# EAGLE design SuperPro-res-moved (EAGLE 6.6.0)
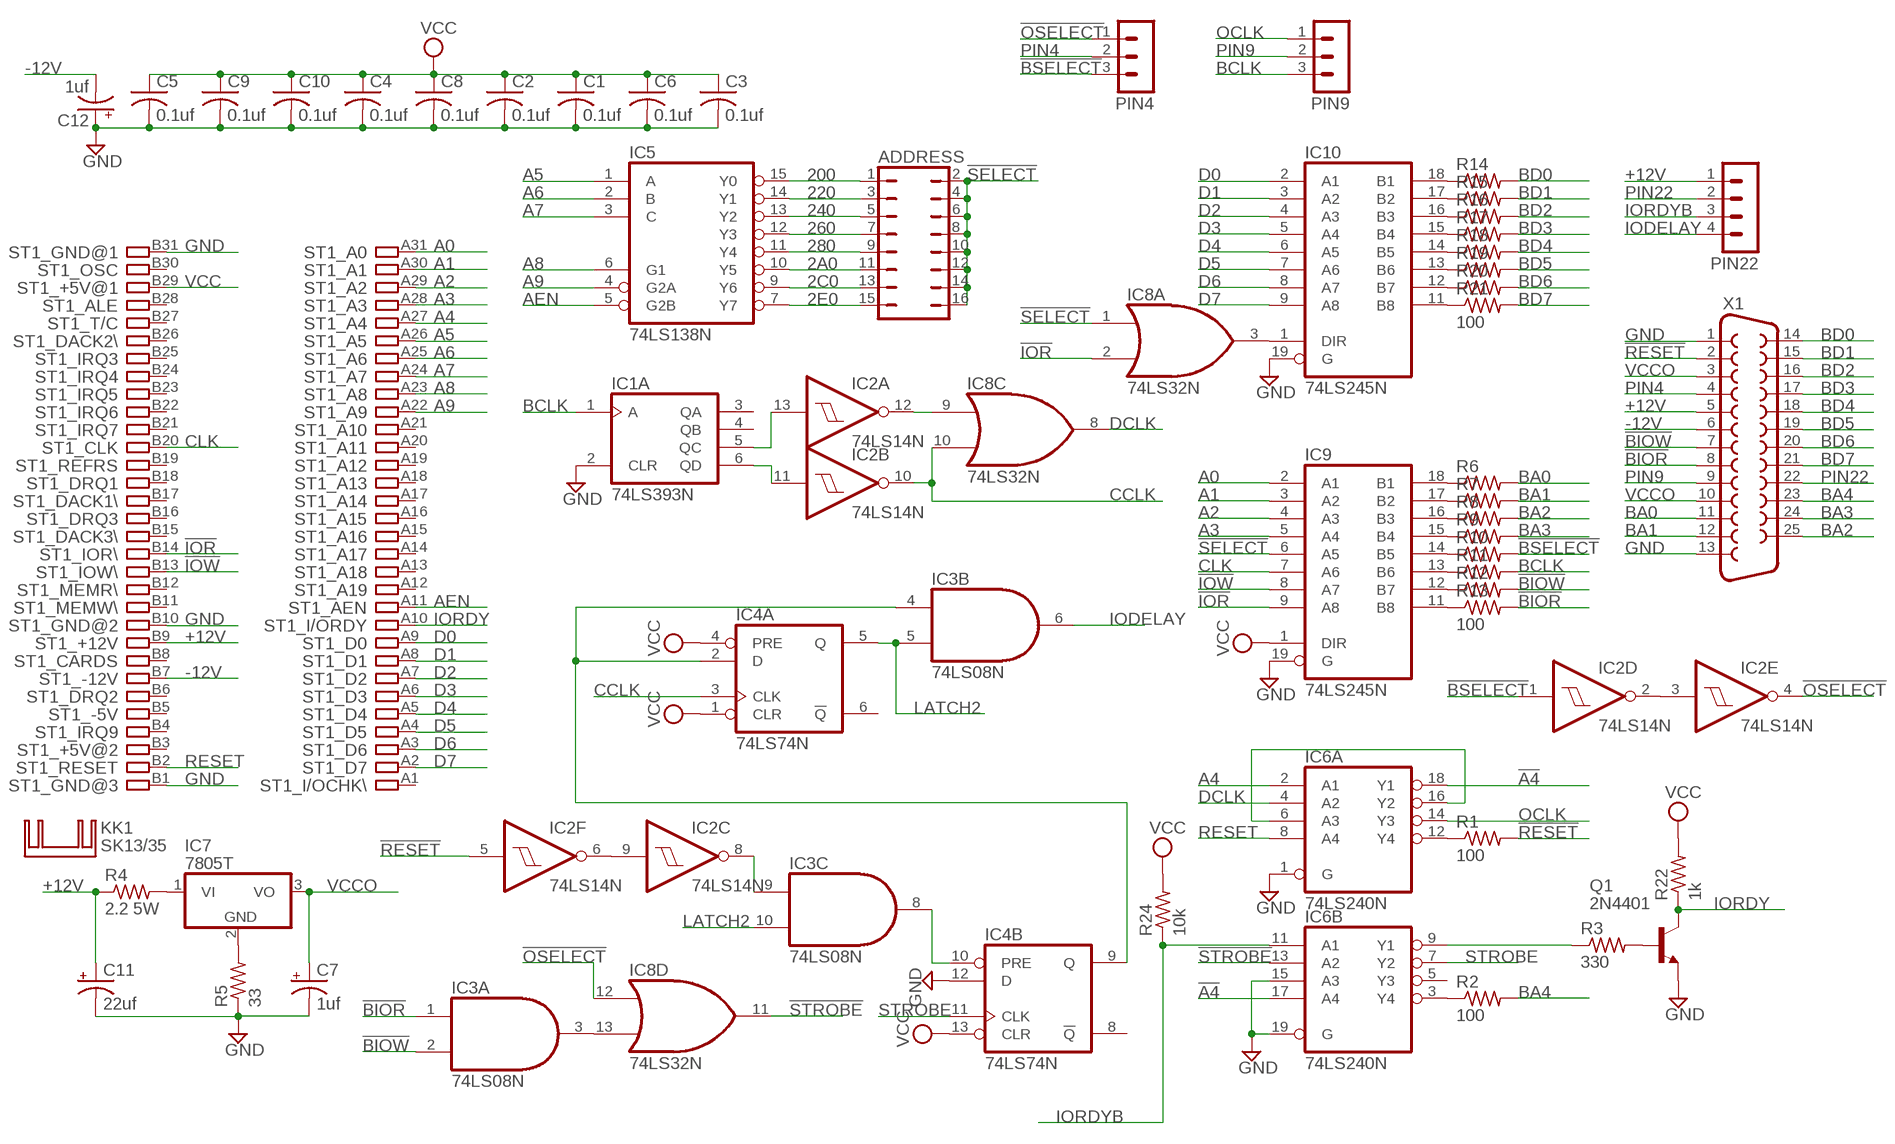
[diagram p0: schematic, sheet 1]

## Parts
ADDRESS  JP8Q  [JP8Q]
C1  0.1uf  C-US050-025X075  [C050-025X075]
C2  0.1uf  C-US050-025X075  [C050-025X075]
C3  0.1uf  C-US050-025X075  [C050-025X075]
C4  0.1uf  C-US050-025X075  [C050-025X075]
C5  0.1uf  C-US050-025X075  [C050-025X075]
C6  0.1uf  C-US050-025X075  [C050-025X075]
C7  1uf  CPOL-USE5-10.5  [E5-10,5]
C8  0.1uf  C-US050-025X075  [C050-025X075]
C9  0.1uf  C-US050-025X075  [C050-025X075]
C10  0.1uf  C-US050-025X075  [C050-025X075]
C11  22uf  CPOL-USE5-10.5  [E5-10,5]
C12  1uf  CPOL-USE5-10.5  [E5-10,5]
IC1  74LS393N  [DIL14]
IC2  74LS14N  [DIL14]
IC3  74LS08N  [DIL14]
IC4  74LS74N  [DIL14]
IC5  74LS138N  [DIL16]
IC6  74LS240N  [DIL20]
IC7  7805T  [TO220H]
IC8  74LS32N  [DIL14]
IC9  74LS245N  [DIL20]
IC10  74LS245N  [DIL20]
KK1  SK13/35  [SK13/35]
PIN4  MA03-1  [MA03-1]
PIN9  MA03-1  [MA03-1]
PIN22  MA04-1  [MA04-1]
Q1  2N4401  2N4416  [TO92]
R1  100  R-US_0207/10  [0207/10]
R2  100  R-US_0207/10  [0207/10]
R3  330  R-US_0207/10  [0207/10]
R4  2.2 5W  R-US_0922/22  [0922/22]
R5  33  R-US_0207/10  [0207/10]
R6  R-US_0207/10  [0207/10]
R7  R-US_0207/10  [0207/10]
R8  R-US_0207/10  [0207/10]
R9  R-US_0207/10  [0207/10]
R10  R-US_0207/10  [0207/10]
R11  R-US_0207/10  [0207/10]
R12  R-US_0207/10  [0207/10]
R13  100  R-US_0207/10  [0207/10]
R14  R-US_0207/10  [0207/10]
R15  R-US_0207/10  [0207/10]
R16  R-US_0207/10  [0207/10]
R17  R-US_0207/10  [0207/10]
R18  R-US_0207/10  [0207/10]
R19  R-US_0207/10  [0207/10]
R20  R-US_0207/10  [0207/10]
R21  100  R-US_0207/10  [0207/10]
R22  1k  R-US_0207/10  [0207/10]
R24  10k  R-US_0207/10  [0207/10]
ST1  IBM8BIT  [IBM8BIT]
X1  F25H  [F25H]

## Nets
2A0: ADDRESS.11 IC5.10(Y5)
2C0: ADDRESS.13 IC5.9(Y6)
2E0: ADDRESS.15 IC5.7(Y7)
200: ADDRESS.1 IC5.15(Y0)
220: ADDRESS.3 IC5.14(Y1)
240: ADDRESS.5 IC5.13(Y2)
260: ADDRESS.7 IC5.12(Y3)
280: ADDRESS.9 IC5.11(Y4)
!A4: IC6.17(B:A4) IC6.18(A:Y1)
!BIOR: IC3.1(A:I0) R13.2 X1.8
!BIOW: IC3.2(A:I1) R12.2 X1.7
!BSELECT: IC2.1(D:I) PIN4.3 R10.2
!IOR: IC8.2(A:I1) IC9.9(A8) ST1.B14
!IOW: IC9.8(A7) ST1.B13
!OSELECT: IC2.4(E:O) IC8.12(D:I0) PIN4.1
!RESET: IC2.5(F:I) R1.2 X1.2
!SELECT: ADDRESS.2 ADDRESS.4 ADDRESS.6 ADDRESS.8 ADDRESS.10 ADDRESS.12 ADDRESS.14 ADDRESS.16 IC8.1(A:I0) IC9.6(A5)
!STROBE: IC6.13(B:A2) IC8.11(D:O)
+12V [Power]: C11.+ PIN22.1 R4.1 ST1.B9 X1.5
-12V [Power]: C12.- ST1.B7 X1.6
A0: IC9.2(A1) ST1.A31
A1: IC9.3(A2) ST1.A30
A2: IC9.4(A3) ST1.A29
A3: IC9.5(A4) ST1.A28
A4: IC6.2(A:A1) ST1.A27
A5: IC5.1(A) ST1.A26
A6: IC5.2(B) ST1.A25
A7: IC5.3(C) ST1.A24
A8: IC5.6(G1) ST1.A23
A9: IC5.4(G2A) ST1.A22
AEN: IC5.5(G2B) ST1.A11
BA0: R6.2 X1.11
BA1: R7.2 X1.12
BA2: R8.2 X1.25
BA3: R9.2 X1.24
BA4: R2.2 X1.23
BCLK: IC1.1(A:A) PIN9.3 R11.2
BD0: R14.2 X1.14
BD1: R15.2 X1.15
BD2: R16.2 X1.16
BD3: R17.2 X1.17
BD4: R18.2 X1.18
BD5: R19.2 X1.19
BD6: R20.2 X1.20
BD7: R21.2 X1.21
CCLK: IC2.10(B:O) IC4.3(A:CLK) IC8.10(C:I1)
CLK: IC9.7(A6) ST1.B20
D0: IC10.2(A1) ST1.A9
D1: IC10.3(A2) ST1.A8
D2: IC10.4(A3) ST1.A7
D3: IC10.5(A4) ST1.A6
D4: IC10.6(A5) ST1.A5
D5: IC10.7(A6) ST1.A4
D6: IC10.8(A7) ST1.A3
D7: IC10.9(A8) ST1.A2
DCLK: IC6.4(A:A2) IC8.8(C:O)
GND: C1.2 C2.2 C3.2 C4.2 C5.2 C6.2 C7.- C8.2 C9.2 C10.2 C11.- C12.+ IC1.2(A:CLR) IC4.12(B:D) IC6.1(A:G) IC6.15(B:A3) IC6.19(B:G) IC9.19(G) IC10.19(G) Q1.3(E) R5.1 ST1.B1 ST1.B10 ST1.B31 X1.1 X1.13
IODELAY: IC3.6(B:O) PIN22.4
IORDY: Q1.1(C) R22.1 ST1.A10
IORDYB: IC6.11(B:A1) PIN22.3 R24.1
LATCH2: IC3.5(B:I1) IC3.10(C:I1) IC4.5(A:Q)
N$1: IC8.3(A:O) IC10.1(DIR)
N$2 [Power]: IC7.2(GND) R5.2
N$3: IC10.13(B6) R19.1
N$4: IC10.17(B2) R15.1
N$5: IC10.16(B3) R16.1
N$6: IC10.15(B4) R17.1
N$7: IC10.14(B5) R18.1
N$8: IC10.12(B7) R20.1
N$9: IC10.11(B8) R21.1
N$10: IC10.18(B1) R14.1
N$11: IC9.18(B1) R6.1
N$12: IC9.17(B2) R7.1
N$13: IC9.16(B3) R8.1
N$14: IC9.15(B4) R9.1
N$15: IC9.14(B5) R10.1
N$16: IC9.13(B6) R11.1
N$17: IC9.12(B7) R12.1
N$18: IC9.11(B8) R13.1
N$19: IC6.12(A:Y4) R1.1
N$20: IC2.6(F:O) IC2.9(C:I)
N$21: IC2.2(D:O) IC2.3(E:I)
N$22: IC1.6(A:QD) IC2.11(B:I)
N$23: IC6.3(B:Y4) R2.1
N$24: IC1.5(A:QC) IC2.13(A:I)
N$25 [Power]: IC7.1(VI) R4.2
N$26: IC2.12(A:O) IC8.9(C:I0)
N$28: IC6.6(A:A3) IC6.16(A:Y2)
N$29: IC3.3(A:O) IC8.13(D:I1)
N$30: IC3.4(B:I0) IC4.2(A:D) IC4.9(B:Q)
N$32: IC6.9(B:Y1) R3.1
N$33: IC3.8(C:O) IC4.10(B:PRE)
N$34: IC2.8(C:O) IC3.9(C:I0)
N$37: Q1.2(B) R3.2
OCLK: IC6.14(A:Y3) PIN9.1
PIN4: PIN4.2 X1.4
PIN9: PIN9.2 X1.9
PIN22 [Power]: PIN22.2 X1.22
RESET: IC6.8(A:A4) ST1.B2
STROBE: IC4.11(B:CLK) IC6.7(B:Y2)
VCC [Power]: C1.1 C2.1 C3.1 C4.1 C5.1 C6.1 C8.1 C9.1 C10.1 IC4.1(A:CLR) IC4.4(A:PRE) IC4.13(B:CLR) IC9.1(DIR) R22.2 R24.2 ST1.B29
VCCO [Power]: C7.+ IC7.3(VO) X1.3 X1.10
Unconnected: IC1.3(A:QA) IC1.4(A:QB) IC1.8(B:QD) IC1.9(B:QC) IC1.10(B:QB) IC1.11(B:QA) IC1.12(B:CLR) IC1.13(B:A) IC3.11(D:O) IC3.12(D:I0) IC3.13(D:I1) IC4.6(A:!Q) IC4.8(B:!Q) IC6.5(B:Y3) IC8.4(B:I0) IC8.5(B:I1) IC8.6(B:O) ST1.A1 ST1.A12 ST1.A13 ST1.A14 ST1.A15 ST1.A16 ST1.A17 ST1.A18 ST1.A19 ST1.A20 ST1.A21 ST1.B3 ST1.B4 ST1.B5 ST1.B6 ST1.B8 ST1.B11 ST1.B12 ST1.B15 ST1.B16 ST1.B17 ST1.B18 ST1.B19 ST1.B21 ST1.B22 ST1.B23 ST1.B24 ST1.B25 ST1.B26 ST1.B27 ST1.B28 ST1.B30

## Power pins joined to a net without a drawn wire
GND: IC1.7(P:GND) IC2.7(P:GND) IC3.7(P:GND) IC4.7(P:GND) IC5.8(GND) IC6.10(P:GND) IC8.7(P:GND) IC9.10(GND) IC10.10(GND)
VCC: IC1.14(P:VCC) IC2.14(P:VCC) IC3.14(P:VCC) IC4.14(P:VCC) IC5.16(VCC) IC6.20(P:VCC) IC8.14(P:VCC) IC9.20(VCC) IC10.20(VCC)

## Library data of the parts
ADDRESS = jumper:JP8Q: JUMPER
C1-C6 C8-C10 = rcl:C-US: CAPACITOR, American symbol
C7 C11 C12 = rcl:CPOL-US: POLARIZED CAPACITOR, American symbol
IC1 = 74xx-us:74*393: Dual 4-bit decade and binary COUNTER
IC2 = 74xx-us:74*14: Hex schmitt trigger INVERTER
IC3 = 74xx-us:74*08: Quad 2-input AND gate
IC4 = 74xx-us:74*74: Dual D type positive edge triggered FLIP FLOP, preset and clear
IC5 = 74xx-us:74*138: 3-line to 8-line DECODER/DEMULTIPLEXER
IC6 = 74xx-us:74*240: Octal BUFFER and LINE DRIVER, 3-state
IC7 = linear:78*: Positive VOLTAGE REGULATOR Source: http://cache.national.com/ds/LM/LM78L05.pdf http://www.fairchildsemi.com/ds/LM/LM7805.pdf
IC8 = 74xx-us:74*32: Quad 2-input OR gate
IC9 IC10 = 74xx-us:74*245: Octal BUS TRANSCEIVER, 3-state
KK1 = heatsink:SK13/35: HEATSINK manufacturer Fischer/distributor Buerklin
PIN4 PIN9 = con-lstb:MA03-1: PIN HEADER; OC_FARNELL: unknown; OC_NEWARK: unknown
PIN22 = con-lstb:MA04-1: PIN HEADER; OC_FARNELL: unknown; OC_NEWARK: unknown
Q1 = transistor-npn:2N4416: NPN Transistor
R1-R22 R24 = rcl:R-US_: RESISTOR, American symbol
ST1 = con-pc:IBM8BIT: 8-bit CARD IBM/PC-AT
X1 = con-subd:F25: SUB-D; OC_FARNELL: unknown; OC_NEWARK: unknown

## Net classes
1 Power: width 0.762 mm, clearance 0.254 mm

## Board
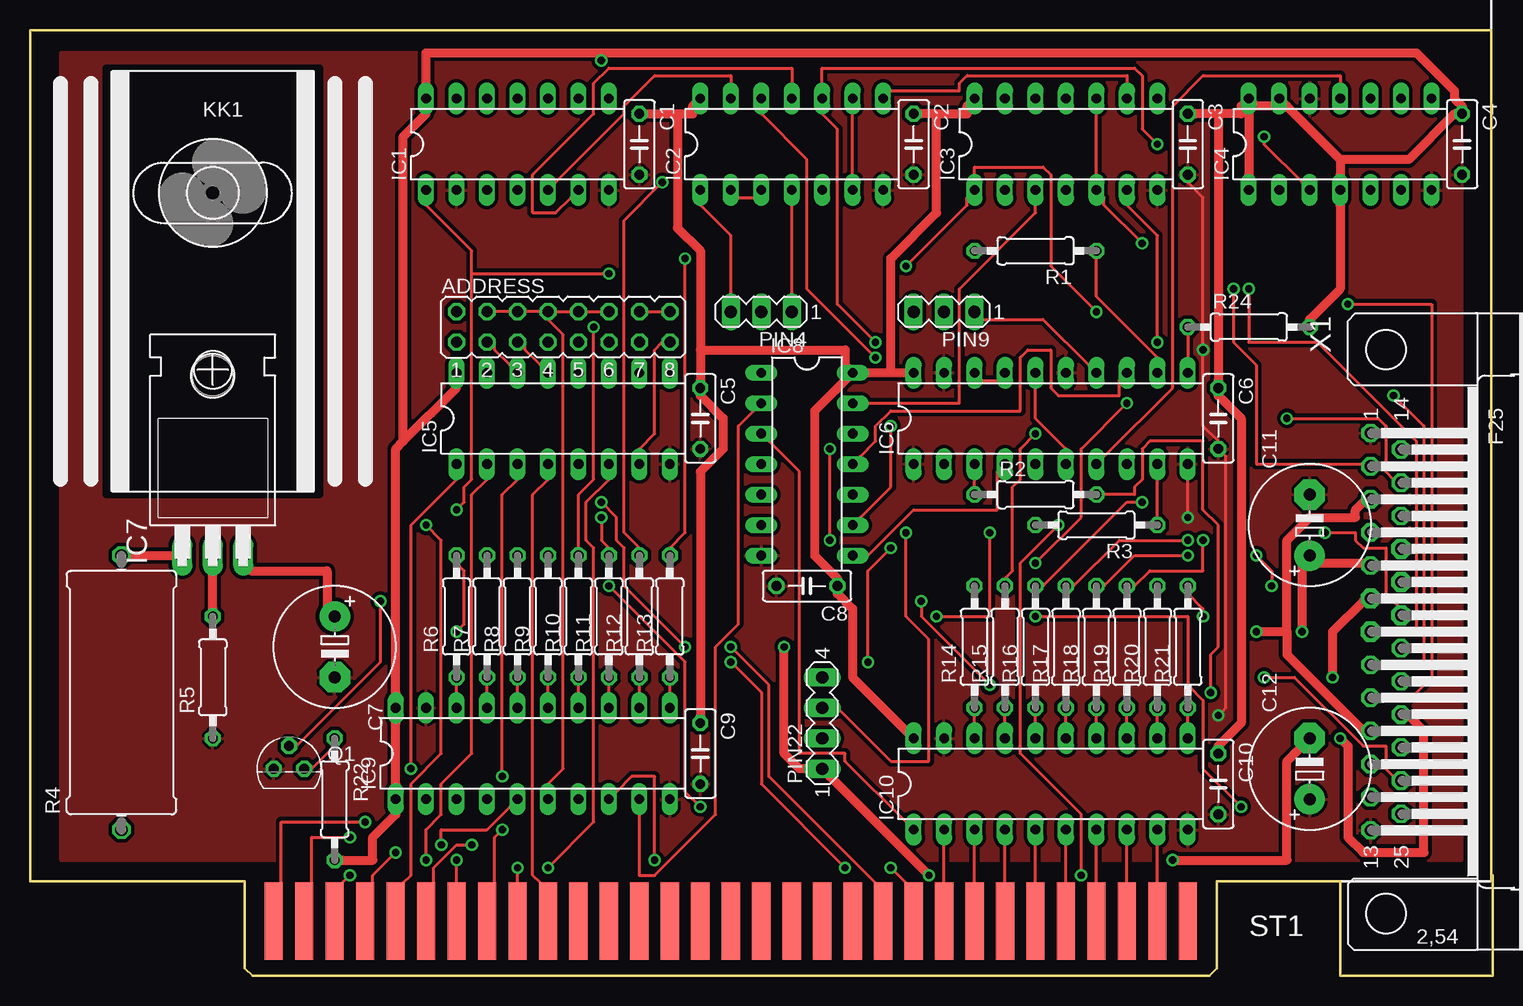
[diagram p1: board, top side]
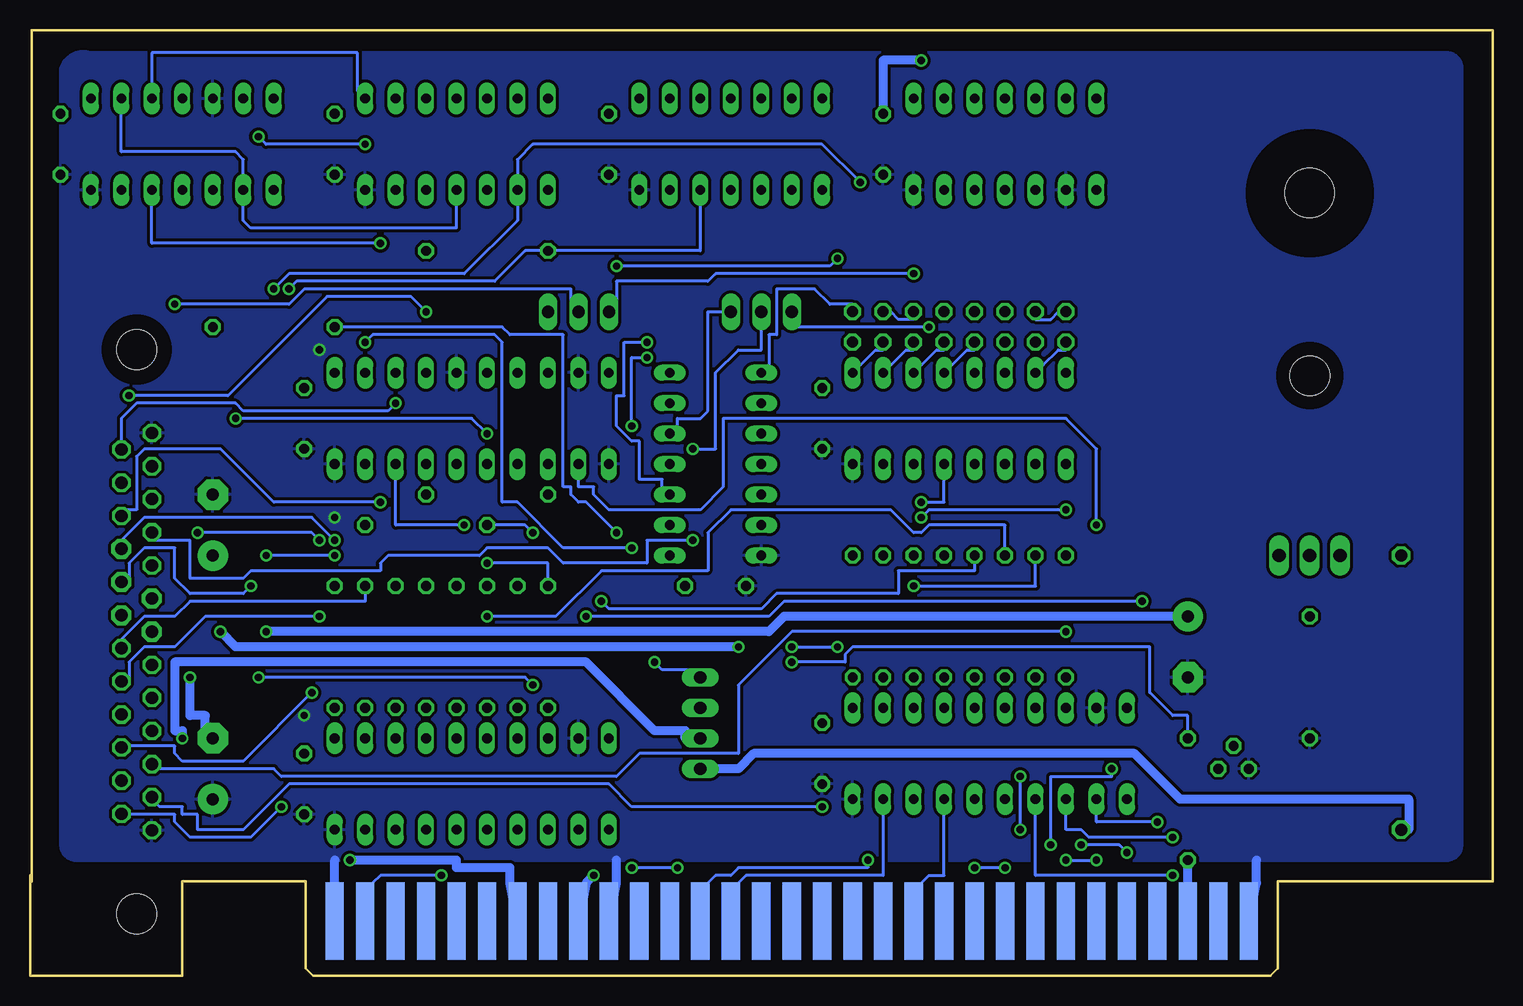
[diagram p2: board, bottom side, seen from below]

Size 121.92 x 78.87 mm. Coordinates in mm from the lower left corner, seen from the top.
Outline: 121.79,7.87 121.79,78.87 0,78.87 0,7.87 17.91,7.87 17.91,0.63 18.54,0 97.79,0 98.3,0 98.93,0.63 98.93,7.87 109.22,7.87 109.22,0 121.92,0 121.92,8.38
Copper layers (1*16): Top 0.035mm / dielectric 1.5mm / Bottom 0.035mm
Design rules "olimex10mil": minimum track width 10mil, minimum drill 24mil, track to track 10mil, track to pad 10mil, pad to pad 10mil, via to via 10mil, smd to smd 10mil, copper to edge 40mil, drill to drill 10mil, minimum pad ring 10mil, minimum via ring 8mil, stop-mask expansion 0mil, vias tented up to drill 0mil, thermal gap 10mil

### Footprints (pad centres in the part's own frame; a part is rotated, then mirrored left to right if it is on the bottom)
JP8Q = drill 0.914 octagon: 1 -8.89,-1.27; 2 -8.89,1.27; 3 -6.35,-1.27; 4 -6.35,1.27; 5 -3.81,-1.27; 6 -3.81,1.27; 7 -1.27,-1.27; 8 -1.27,1.27; 9 1.27,-1.27; 10 1.27,1.27; 11 3.81,-1.27; 12 3.81,1.27; 13 6.35,-1.27; 14 6.35,1.27; 15 8.89,-1.27; 16 8.89,1.27
C050-025X075 = drill 0.813 octagon: 1 -2.54,0; 2 2.54,0
E5-10,5 = drill 1.016 pad 2.54: + -2.54,0 | drill 1.016 pad 2.54 octagon: - 2.54,0
DIL14 = drill 0.813 long: 1 -7.62,-3.81; 2 -5.08,-3.81; 3 -2.54,-3.81; 4 0,-3.81; 5 2.54,-3.81; 6 5.08,-3.81; 7 7.62,-3.81; 8 7.62,3.81; 9 5.08,3.81; 10 2.54,3.81; 11 0,3.81; 12 -2.54,3.81; 13 -5.08,3.81; 14 -7.62,3.81
DIL16 = drill 0.813 long: 1 -8.89,-3.81; 2 -6.35,-3.81; 3 -3.81,-3.81; 4 -1.27,-3.81; 5 1.27,-3.81; 6 3.81,-3.81; 7 6.35,-3.81; 8 8.89,-3.81; 9 8.89,3.81; 10 6.35,3.81; 11 3.81,3.81; 12 1.27,3.81; 13 -1.27,3.81; 14 -3.81,3.81; 15 -6.35,3.81; 16 -8.89,3.81
DIL20 = drill 0.813 long: 1 -11.43,-3.81; 2 -8.89,-3.81; 3 -6.35,-3.81; 4 -3.81,-3.81; 5 -1.27,-3.81; 6 1.27,-3.81; 7 3.81,-3.81; 8 6.35,-3.81; 9 8.89,-3.81; 10 11.43,-3.81; 11 11.43,3.81; 12 8.89,3.81; 13 6.35,3.81; 14 3.81,3.81; 15 1.27,3.81; 16 -1.27,3.81; 17 -3.81,3.81; 18 -6.35,3.81; 19 -8.89,3.81; 20 -11.43,3.81
TO220H = drill 1.118 long: 1 -2.54,-10.16; 2 0,-10.16; 3 2.54,-10.16 | hole 3.302: 0,4.826
MA03-1 = drill 1.016 long: 1 -2.54,0; 2 0,0; 3 2.54,0
MA04-1 = drill 1.016 long: 1 -3.81,0; 2 -1.27,0; 3 1.27,0; 4 3.81,0
TO92 = drill 0.813 octagon: 1 1.27,0; 2 0,1.905; 3 -1.27,0
0207/10 = drill 0.813 octagon: 1 -5.08,0; 2 5.08,0
0922/22 = drill 1.016 octagon: 1 -11.43,0; 2 11.43,0
IBM8BIT = smd 1.524 x 6.477: A1 -25.4,5.08; A2 -27.94,5.08; A3 -30.48,5.08; A4 -33.02,5.08; A5 -35.56,5.08; A6 -38.1,5.08; A7 -40.64,5.08; A8 -43.18,5.08; A9 -45.72,5.08; A10 -48.26,5.08; A11 -50.8,5.08; A12 -53.34,5.08; A13 -55.88,5.08; A14 -58.42,5.08; A15 -60.96,5.08; A16 -63.5,5.08; A17 -66.04,5.08; A18 -68.58,5.08; A19 -71.12,5.08; A20 -73.66,5.08; A21 -76.2,5.08; A22 -78.74,5.08; A23 -81.28,5.08; A24 -83.82,5.08; A25 -86.36,5.08; A26 -88.9,5.08; A27 -91.44,5.08; A28 -93.98,5.08; A29 -96.52,5.08; A30 -99.06,5.08; A31 -101.6,5.08 | smd 1.524 x 6.477 bottom: B1 -25.4,5.08; B2 -27.94,5.08; B3 -30.48,5.08; B4 -33.02,5.08; B5 -35.56,5.08; B6 -38.1,5.08; B7 -40.64,5.08; B8 -43.18,5.08; B9 -45.72,5.08; B10 -48.26,5.08; B11 -50.8,5.08; B12 -53.34,5.08; B13 -55.88,5.08; B14 -58.42,5.08; B15 -60.96,5.08; B16 -63.5,5.08; B17 -66.04,5.08; B18 -68.58,5.08; B19 -71.12,5.08; B20 -73.66,5.08; B21 -76.2,5.08; B22 -78.74,5.08; B23 -81.28,5.08; B24 -83.82,5.08; B25 -86.36,5.08; B26 -88.9,5.08; B27 -91.44,5.08; B28 -93.98,5.08; B29 -96.52,5.08; B30 -99.06,5.08; B31 -101.6,5.08
4,1 = hole 4.1: 0,0
F25H = drill 1.016 octagon: 1 -16.561,-1.27; 2 -13.792,-1.27; 3 -11.049,-1.27; 4 -8.28,-1.27; 5 -5.512,-1.27; 8 2.769,-1.27; 9 5.512,-1.27; 10 8.28,-1.27; 11 11.049,-1.27; 12 13.792,-1.27; 13 16.561,-1.27; 14 -15.189,1.27; 15 -12.421,1.27; 16 -9.652,1.27; 20 1.372,1.27; 21 4.14,1.27; 22 6.909,1.27; 23 9.652,1.27; 24 12.421,1.27; 25 15.189,1.27 | drill 1.016 pad 1.67 octagon: 6 -2.769,-1.27; 7 0,-1.27; 17 -6.909,1.27; 18 -4.14,1.27; 19 -1.372,1.27 | hole 3.302: -23.52,0; 23.52,0

### Placement (x,y rotation side)
ADDRESS  44.45,54.1 0 top
C1  50.8,69.34 270 top
C2  73.66,69.34 270 top
C3  96.52,69.34 270 top
C4  119.38,69.34 270 top
C5  55.88,46.48 270 top
C6  99.06,46.48 270 top
C7  25.4,27.43 270 top
C8  64.77,32.51 180 top
C9  55.88,18.54 270 top
C10  99.06,16 270 top
C11  106.68,37.59 90 top
C12  106.68,17.27 90 top
IC1  40.64,69.34 0 top
IC2  63.5,69.34 0 top
IC3  86.36,69.34 0 top
IC4  109.22,69.34 0 top
IC5  44.45,46.48 0 top
IC6  85.09,46.48 0 top
IC7  15.24,45.21 0 top
IC8  64.77,42.67 270 top
IC9  41.91,18.54 0 top
IC10  85.09,16 0 top
KK1  15.24,61.72 90 top
PIN4  60.96,55.37 180 top
PIN9  76.2,55.37 180 top
PIN22  66.04,21.08 90 top
Q1  21.59,17.27 0 top
R1  83.82,60.45 180 top
R2  83.82,40.13 0 top
R3  88.9,37.59 180 top
R4  7.62,23.62 90 top
R5  15.24,24.89 90 top
R6  35.56,29.97 90 top
R7  38.1,29.97 90 top
R8  40.64,29.97 90 top
R9  43.18,29.97 90 top
R10  45.72,29.97 90 top
R11  48.26,29.97 90 top
R12  50.8,29.97 90 top
R13  53.34,29.97 90 top
R14  78.74,27.43 90 top
R15  81.28,27.43 90 top
R16  83.82,27.43 90 top
R17  86.36,27.43 90 top
R18  88.9,27.43 90 top
R19  91.44,27.43 90 top
R20  93.98,27.43 90 top
R21  96.52,27.43 90 top
R22  25.4,14.73 270 top
R24  101.6,54.1 0 top
ST1  121.92,-0.51 0 top
U$1  [4,1]  15.24,65.28 0 top
X1  113.03,28.7 270 top

### Tracks (layer width: path | path; a pad name or v marks a point on that pad's centre or on a via)
2A0
  Bottom 0.254: IC5.10 50.16,50.93 48.89,52.2 48.26,52.2 ADDRESS.11
2C0
  Bottom 0.254: IC5.9 52.7,50.93 51.44,52.2 50.8,52.2 ADDRESS.13
2E0
  Top 0.254: IC5.7 50.8,43.94 52.07,45.21 52.07,52.2 52.7,52.83 ADDRESS.15
200
  Bottom 0.254: IC5.15 37.47,50.93 36.2,52.2 35.56,52.2 ADDRESS.1
220
  Top 0.254: IC5.14 40.01,50.93 38.73,52.2 38.73,52.83 ADDRESS.3
240
  Top 0.254: IC5.13 42.55,50.93 41.28,52.2 41.28,52.83 ADDRESS.5
260
  Bottom 0.254: IC5.12 45.09,50.93 43.81,52.2 43.18,52.2 ADDRESS.7
280
  Bottom 0.254: IC5.11 47.62,50.93 46.36,52.2 45.72,52.2 ADDRESS.9
!A4
  Top 0.254: IC6.18 79.38,49.66 80.65,49.66 IC6.17
!BIOR  (via drill 0.61)
  Top 0.254: v54.61,59.82 54.61,36.96 53.34,35.69 R13.2 | v73.03,59.18 78.11,64.26 78.11,64.9 IC3.1 78.74,66.8 78.74,67.44 84.45,67.44 85.09,66.8 85.09,59.18 v88.9,55.37 | v113.67,48.39 116.2,45.85 116.2,26.16 112.39,26.16 X1.8
  Bottom 0.254: v54.61,59.82 55.25,59.18 v73.03,59.18 | v113.67,48.39 105.41,48.39 97.16,56.64 90.17,56.64 v88.9,55.37
!BIOW  (via drill 0.61)
  Top 0.254: v52.7,66.17 49.53,62.99 49.53,36.96 50.8,35.69 R12.2 | v101.6,57.28 101.6,52.83 107.31,52.83 115.57,44.58 115.57,28.7 112.39,28.7 X1.7
  Bottom 0.254: v52.7,66.17 55.88,69.34 80.01,69.34 81.28,68.07 81.28,66.8 IC3.2 81.28,64.26 81.28,62.99 85.72,58.55 100.33,58.55 v101.6,57.28
!BSELECT  (via drill 0.61)
  Top 0.254: v46.99,54.1 46.99,41.4 45.72,40.13 45.72,35.69 R10.2 | IC2.1 55.88,64.26 58.42,61.72 58.42,56.64 PIN4.3
  Bottom 0.254: v46.99,54.1 58.42,54.1 PIN4.3
!IOR
  Top 0.254: IC8.2 60.33,47.12 59.05,45.85 59.05,29.34 57.15,27.43 57.15,13.46 52.07,8.38 50.8,8.38 50.8,13.46 IC9.9
  Bottom 0.254: IC9.9 50.8,13.46 50.8,8.38 62.23,8.38 62.87,7.75 ST1.B14
!IOW  (via drill 0.61)
  Top 0.254: v52.07,9.65 52.07,16.64 50.16,16.64 48.89,15.37 IC9.8
  Bottom 0.254: v52.07,9.65 52.07,9.02 62.87,9.02 63.5,8.38 64.77,8.38 65.41,7.75 ST1.B13
!OSELECT
  Top 0.254: IC2.4 63.5,64.26 63.5,56.64 PIN4.1
  Bottom 0.254: IC8.12 67.94,45.85 67.94,46.48 66.04,46.48 65.41,47.12 65.41,55.37 64.13,55.37 PIN4.1
!RESET  (via drill 0.61)
  Top 0.254: v100.33,57.28 100.33,52.83 102.23,50.93 102.23,42.67 111.12,42.67 X1.2
  Bottom 0.254: IC2.5 66.04,64.26 66.04,60.45 78.11,60.45 R1.2 79.38,60.45 80.65,60.45 83.19,57.91 99.7,57.91 v100.33,57.28
!SELECT
  Top 0.254: ADDRESS.14 51.44,55.37 52.7,55.37 ADDRESS.16 | ADDRESS.4 38.73,55.37 40.01,55.37 ADDRESS.6 41.28,55.37 42.55,55.37 ADDRESS.8 | IC9.6 43.18,16 44.45,17.27 44.45,53.47 43.18,54.74 ADDRESS.8 | ADDRESS.8 43.81,55.37 45.09,55.37 ADDRESS.10 46.36,55.37 47.62,55.37 ADDRESS.12
  Bottom 0.254: IC8.1 60.33,50.93 60.33,53.47 59.69,53.47 59.69,57.28 56.52,57.28 55.25,56.01 53.34,56.01 ADDRESS.16 | ADDRESS.2 36.2,55.37 36.83,54.74 38.1,54.74 ADDRESS.4 | ADDRESS.14 50.16,55.37 49.53,54.74 48.26,54.74 ADDRESS.12
!STROBE
  Top 0.254: IC8.11 69.22,43.31 70.48,44.58 70.48,45.85 71.75,47.12 82.55,47.12 82.55,51.56 83.19,52.2 85.09,52.2 85.09,49.02 85.72,48.39 90.81,48.39 90.81,49.66 IC6.13
+12V  (via drill 0.61)
  Top 0.762: X1.5 111.12,34.42 107.31,34.42 C11.+ 106.05,34.42 v106.05,28.7 | v62.87,27.43 62.87,18.54 64.13,17.27 64.77,17.27 PIN22.1 66.68,16.64 v74.93,8.38
  Bottom 0.762: R4.1 6.99,12.19 6.99,14.73 26.04,14.73 29.84,18.54 61.59,18.54 62.87,17.27 64.77,17.27 PIN22.1 | v106.05,28.7 104.78,27.43 v62.87,27.43 | v74.93,8.38 75.56,7.75 ST1.B9
-12V  (via drill 0.61)
  Top 0.762: v108.59,24.89 108.59,28.7 111.12,31.24 X1.6 | v95.25,9.65 104.78,9.65 104.78,17.91 106.05,19.18 C12.-
  Bottom 0.762: v108.59,24.89 108.59,21.72 107.31,21.72 107.31,20.45 C12.- | v95.25,9.65 86.36,9.65 86.36,9.02 81.92,9.02 81.92,7.75 ST1.B7
A0  (via drill 0.61)
  Top 0.254: v27.94,12.83 20.96,12.83 20.96,7.75 ST1.A31
  Bottom 0.254: v27.94,12.83 33.02,12.83 33.02,13.46 IC9.2
A1  (via drill 0.61)
  Top 0.254: v26.67,11.56 23.5,11.56 23.5,7.75 ST1.A30
  Bottom 0.254: v26.67,11.56 33.66,11.56 34.29,12.19 35.56,12.19 35.56,13.46 IC9.3
A2  (via drill 0.61)
  Top 0.254: v26.67,8.38 26.04,7.75 ST1.A29
  Bottom 0.254: v26.67,8.38 38.1,8.38 38.1,13.46 IC9.4
A3  (via drill 0.61)
  Top 0.254: v34.29,10.92 34.29,12.19 38.1,12.19 40.01,14.1 IC9.5 | v30.48,10.29 28.58,8.38 28.58,7.75 ST1.A28
  Bottom 0.254: v34.29,10.92 31.12,10.92 v30.48,10.29
A4  (via drill 0.61)
  Top 0.254: v33.02,37.59 34.29,36.32 34.29,18.54 31.75,16 31.75,8.38 31.12,7.75 ST1.A27
  Bottom 0.254: v33.02,37.59 33.02,43.94 35.56,46.48 64.13,46.48 64.13,40.77 66.04,38.86 73.66,38.86 74.93,40.13 74.93,40.77 76.2,40.77 76.2,41.4 IC6.2
A5  (via drill 0.61)
  Top 0.254: v31.75,17.27 31.75,37.59 35.56,41.4 IC5.1 | v36.83,10.92 35.56,10.92 33.66,9.02 33.66,7.75 ST1.A26
  Bottom 0.254: v31.75,17.27 31.75,16.64 36.83,16.64 v36.83,10.92
A6  (via drill 0.61)
  Top 0.254: v33.02,9.65 33.02,12.19 34.29,13.46 34.29,16 36.83,18.54 36.83,40.13 38.1,41.4 IC5.2 | v35.56,9.65 35.56,7.75 ST1.A25
  Bottom 0.254: v35.56,9.65 v33.02,9.65
A7  (via drill 0.61)
  Top 0.254: v39.37,16.64 39.37,40.13 40.64,41.4 IC5.3 | v39.37,12.19 38.73,11.56 38.73,7.75 ST1.A24
  Bottom 0.254: v39.37,12.19 v39.37,16.64
A8  (via drill 0.61)
  Top 0.254: v43.18,9.02 46.99,12.83 46.99,35.69 46.36,36.32 46.36,39.5 48.26,41.4 IC5.6 | v40.64,9.02 40.64,7.75 ST1.A23
  Bottom 0.254: v40.64,9.02 v43.18,9.02
A9
  Top 0.254: IC5.4 43.18,41.4 41.91,40.13 41.91,8.38 42.55,7.75 ST1.A22
AEN  (via drill 0.61)
  Top 0.254: v47.62,39.5 48.89,38.23 48.89,36.32 49.53,35.69 49.53,32.51 v54.61,27.43 | v58.42,27.43 61.59,24.26 61.59,16.64 70.48,7.75 ST1.A11
  Bottom 0.254: v47.62,39.5 45.72,39.5 45.72,41.4 IC5.5 | v58.42,27.43 v54.61,27.43
BA0  (via drill 0.61)
  Top 0.254: v35.56,28.7 36.2,29.34 36.2,33.78 35.56,34.42 R6.2
  Bottom 0.254: v35.56,28.7 58.42,28.7 62.87,24.26 62.87,18.54 71.12,18.54 73.03,16.64 100.97,16.64 101.6,17.27 111.12,17.27 X1.11
BA1  (via drill 0.61)
  Top 0.254: v48.26,32.51 54.61,26.16 54.61,15.37 v55.88,14.1
  Bottom 0.254: v48.26,32.51 38.1,32.51 38.1,34.42 R7.2 | v55.88,14.1 71.75,14.1 73.66,16 100.33,16 104.14,12.19 107.95,12.19 107.95,13.46 109.22,13.46 109.22,14.1 111.12,14.1 111.76,14.73 X1.12
BA2  (via drill 0.61)
  Top 0.254: v83.82,29.97 96.52,29.97 96.52,24.26 97.79,22.99 97.79,17.27 v100.97,14.1
  Bottom 0.254: v83.82,29.97 78.11,29.97 74.3,33.78 65.41,33.78 65.41,36.96 63.5,38.86 50.16,38.86 48.26,36.96 47.62,36.96 46.99,37.59 40.64,37.59 40.64,35.69 R8.2 | v100.97,14.1 103.5,11.56 108.59,11.56 109.86,12.83 109.86,13.46 113.67,13.46 X1.25
BA3  (via drill 0.61)
  Top 0.254: v74.3,31.24 74.3,29.97 v80.01,24.26 | v102.87,24.89 105.41,24.89 111.12,19.18 113.03,19.18 113.03,17.27 113.67,16.64 X1.24
  Bottom 0.254: v74.3,31.24 73.66,30.61 60.96,30.61 59.69,31.88 49.53,31.88 49.53,33.78 43.18,33.78 43.18,34.42 R9.2 | v80.01,24.26 80.65,24.89 v102.87,24.89
BA4  (via drill 0.61)
  Top 0.254: v98.42,23.62 98.42,26.8 99.06,27.43 99.06,37.59 97.79,38.86 97.79,44.58 93.34,44.58 92.71,43.94 92.71,41.4 92.08,40.77 92.08,40.13 89.53,40.13 R2.2
  Bottom 0.254: v98.42,23.62 104.14,17.91 109.22,17.91 109.86,18.54 109.86,19.18 113.67,19.18 X1.23
BCLK  (via drill 0.61)
  Top 0.254: v47.62,38.23 47.62,36.32 48.26,35.69 R11.2 | v35.56,38.86 36.2,39.5 36.2,40.77 36.83,41.4 36.83,58.55 | 36.83,58.55 36.83,60.45 33.02,64.26 IC1.1 | 36.83,58.55 v48.26,58.55
  Bottom 0.254: v47.62,38.23 46.99,38.86 v35.56,38.86 | v48.26,58.55 64.77,58.55 65.41,57.91 73.03,57.91 73.03,56.01 PIN9.3
BD0  (via drill 0.61)
  Top 0.254: v83.82,34.42 87.63,38.23 87.63,43.94 v91.44,47.75
  Bottom 0.254: v83.82,34.42 78.74,34.42 78.74,33.15 R14.2 | v91.44,47.75 92.08,47.12 104.14,47.12 104.78,47.75 113.03,47.75 114.3,46.48 114.3,44.58 X1.14
BD1  (via drill 0.61)
  Top 0.254: v83.82,45.21 82.55,43.94 82.55,41.4 81.92,40.77 81.92,33.78 81.28,33.15 R15.2 | v104.78,46.48 112.39,46.48 113.03,45.85 113.03,42.04 113.67,41.4 X1.15
  Bottom 0.254: v83.82,45.21 85.09,46.48 v104.78,46.48
BD2  (via drill 0.61)
  Top 0.254: v92.71,39.5 91.44,39.5 84.45,32.51 R16.2
  Bottom 0.254: v92.71,39.5 101.6,39.5 106.05,43.94 112.39,43.94 113.03,43.31 113.03,38.86 114.3,38.86 X1.16
BD3  (via drill 0.61)
  Top 0.254: v96.52,36.32 90.81,36.32 87,32.51 R17.2
  Bottom 0.254: v96.52,36.32 98.42,38.23 112.39,38.23 114.3,36.32 X1.17
BD4  (via drill 0.61)
  Top 0.254: v96.52,35.05 92.08,35.05 89.53,32.51 R18.2 | v102.23,35.05 103.5,33.78 v103.5,32.51
  Bottom 0.254: v96.52,35.05 v102.23,35.05 | v103.5,32.51 104.14,31.88 108.59,31.88 109.86,33.15 109.86,35.69 112.39,35.69 113.67,34.42 113.67,33.15 X1.18
BD5  (via drill 0.61)
  Top 0.254: v97.79,36.32 97.79,33.78 93.34,33.78 92.08,32.51 R19.2 | v107.95,36.96 110.49,36.96 110.49,36.32 111.12,35.69 113.03,35.69 113.03,31.88 114.3,30.61 X1.19
  Bottom 0.254: v97.79,36.32 98.42,36.96 v107.95,36.96
BD6
  Bottom 0.254: R20.2 93.98,31.88 93.98,31.24 108.59,31.24 109.86,29.97 112.39,29.97 114.3,28.07 X1.20
BD7  (via drill 0.61)
  Top 0.254: v97.79,29.97 97.79,30.61 96.52,31.88 R21.2
  Bottom 0.254: v97.79,29.97 107.31,29.97 109.86,27.43 112.39,27.43 113.67,26.16 113.67,24.89 X1.21
CCLK  (via drill 0.61)
  Top 0.254: v70.48,52.83 67.31,56.01 67.31,70.61 66.04,71.88 IC2.10 66.04,74.42 66.04,75.69 92.08,75.69 92.71,75.06 92.71,70.61 v93.98,69.34 | v102.87,69.98 102.87,69.34 106.05,66.17 IC4.3
  Bottom 0.254: v70.48,52.83 72.39,52.83 72.39,48.39 73.03,48.39 73.03,45.85 71.75,44.58 71.12,44.58 71.12,41.4 69.22,41.4 69.22,40.77 IC8.10 | v102.87,69.98 102.23,69.34 v93.98,69.34
CLK
  Bottom 0.254: IC9.7 45.72,13.46 45.72,8.38 46.99,8.38 47.62,7.75 ST1.B20
D0
  Top 0.254: IC10.2 76.2,10.92 76.2,7.75 ST1.A9
D1
  Top 0.254: IC10.3 78.74,10.92 78.74,7.75 ST1.A8
D2
  Top 0.254: IC10.4 81.28,10.92 81.28,7.75 ST1.A7
D3
  Top 0.254: IC10.5 83.82,10.92 83.82,7.75 ST1.A6
D4
  Top 0.254: IC10.6 86.36,10.92 86.36,7.75 ST1.A5
D5
  Top 0.254: IC10.7 88.9,10.92 88.9,7.75 ST1.A4
D6
  Top 0.254: IC10.8 91.44,10.92 91.44,7.75 ST1.A3
D7
  Top 0.254: IC10.9 93.98,10.92 93.98,7.75 ST1.A2
DCLK
  Top 0.254: IC8.8 69.85,35.05 73.66,38.86 80.65,38.86 80.65,42.04 IC6.4
GND  (via drill 0.61)
  Top 0.254: C3.2 96.52,66.17 97.79,64.9 v97.79,52.2 97.79,45.85 99.06,44.58 C6.2 99.7,43.31 99.7,22.35 v99.06,21.72 | v96.52,38.23 96.52,41.4 IC6.10
  Bottom 0.762: 19.69,9.65 19.69,7.75 ST1.B31 | 73.03,9.65 73.03,7.75 ST1.B10 | 96.52,9.65 96.52,7.75 ST1.B1
  pour Bottom (isolate 0.254): 2.54,10.92 2.54,75.69 arc-90 3.81,76.96 116.84,76.96 arc-90 119.38,75.69 119.38,10.92 arc-90 118.11,9.65 3.81,9.65 arc-90
  pour Top (isolate 0.305): 2.54,76.96 2.54,9.65 119.38,9.65 119.38,76.96
IODELAY  (via drill 0.61)
  Top 0.254: v93.98,52.83 93.98,61.72 91.44,64.26 IC3.6 | v71.75,35.69 69.85,33.78 v69.85,26.16
  Bottom 0.254: v93.98,52.83 93.34,53.47 83.19,53.47 82.55,52.83 82.55,39.5 81.28,39.5 77.47,35.69 v71.75,35.69 | v69.85,26.16 69.22,25.53 66.68,25.53 PIN22.4
IORDY  (via drill 0.61)
  Top 0.254: Q1.1 23.5,17.27 25.4,19.18 R22.1 | v58.42,26.16 60.96,23.62 60.96,16 v67.94,9.02 | v71.75,9.02 73.03,7.75 ST1.A10
  Bottom 0.254: v58.42,26.16 53.98,26.16 53.98,26.8 53.34,27.43 28.58,27.43 28.58,23.62 26.67,21.72 25.4,21.72 25.4,20.45 R22.1 | v67.94,9.02 v71.75,9.02
IORDYB  (via drill 0.61)
  Top 0.254: IC6.11 96.52,51.56 96.52,53.47 R24.1 | v73.03,36.96 73.03,29.97 74.93,28.07 74.93,17.91 71.75,17.91 67.31,22.35 PIN22.3
  Bottom 0.254: v73.03,36.96 75.56,39.5 76.2,39.5 76.84,40.13 76.84,40.77 77.47,40.77 77.47,53.47 81.92,53.47 82.55,54.1 95.89,54.1 R24.1
LATCH2  (via drill 0.61)
  Top 0.254: IC3.10 88.9,71.88 88.9,66.8 IC3.5 89.53,64.9 89.53,64.26 v92.71,61.09
  Bottom 0.254: v92.71,61.09 111.76,61.09 111.76,64.26 IC4.5
N$1
  Top 0.254: IC10.1 73.03,12.83 67.94,17.91 67.94,18.54 64.13,18.54 64.13,42.04 61.59,44.58 IC8.3
N$2
  Top 0.762: R5.2 15.24,30.61 15.24,33.78 IC7.2
N$3
  Top 0.254: IC10.13 91.44,21.08 91.44,21.72 R19.1
N$4
  Top 0.254: IC10.17 81.28,21.08 81.28,21.72 R15.1
N$5
  Top 0.254: IC10.16 83.82,21.08 83.82,21.72 R16.1
N$6
  Top 0.254: IC10.15 86.36,21.08 86.36,21.72 R17.1
N$7
  Top 0.254: IC10.14 88.9,21.08 88.9,21.72 R18.1
N$8
  Top 0.254: IC10.12 93.98,21.08 93.98,21.72 R20.1
N$9
  Top 0.254: IC10.11 96.52,21.08 96.52,21.72 R21.1
N$10
  Top 0.254: IC10.18 78.74,21.08 78.74,21.72 R14.1
N$11
  Top 0.254: IC9.18 35.56,23.62 35.56,24.26 R6.1
N$12
  Top 0.254: IC9.17 38.1,23.62 38.1,24.26 R7.1
N$13
  Top 0.254: IC9.16 40.64,23.62 40.64,24.26 R8.1
N$14
  Top 0.254: IC9.15 43.18,23.62 43.18,24.26 R9.1
N$15
  Top 0.254: IC9.14 45.72,23.62 45.72,24.26 R10.1
N$16
  Top 0.254: IC9.13 48.26,23.62 48.26,24.26 R11.1
N$17
  Top 0.254: IC9.12 50.8,23.62 50.8,24.26 R12.1
N$18
  Top 0.254: IC9.11 53.34,23.62 53.34,24.26 R13.1
N$19
  Top 0.254: IC6.12 93.98,51.56 88.9,56.64 88.9,59.82 R1.1
N$20
  Top 0.254: IC2.6 68.58,66.8 68.58,71.88 IC2.9
N$21
  Top 0.254: IC2.2 59.05,64.9 60.33,64.9 IC2.3
N$22
  Top 0.254: IC1.6 45.09,64.9 43.81,63.63 41.91,63.63 41.91,66.8 46.99,71.88 46.99,74.42 48.26,75.69 63.5,75.69 63.5,74.42 IC2.11
N$23
  Top 0.254: R2.1 78.74,40.77 78.74,41.4 IC6.3
N$24
  Top 0.254: IC1.5 43.81,66.17 49.53,71.88 49.53,72.52 52.07,75.06 58.42,75.06 58.42,74.42 IC2.13
N$25
  Top 0.762: R4.2 8.26,35.05 12.07,35.05 IC7.1
N$26  (via drill 0.61)
  Top 0.254: v71.75,45.85 71.75,40.77 69.22,38.23 IC8.9 | v70.48,51.56 64.77,57.28 64.77,68.07 60.96,71.88 IC2.12
  Bottom 0.254: v71.75,45.85 71.75,51.56 v70.48,51.56
N$28
  Top 0.254: IC6.6 86.36,43.94 83.82,46.48 83.82,49.02 IC6.16
N$29
  Top 0.254: IC8.13 69.85,47.75 77.47,47.75 77.47,57.28 83.82,63.63 83.82,64.26 IC3.3
N$30
  Bottom 0.254: IC3.4 86.36,64.26 86.36,62.36 103.5,62.36 104.14,62.99 104.14,64.26 IC4.2 104.14,66.8 104.14,68.07 104.78,68.71 114.3,68.71 114.3,71.88 IC4.9
N$32
  Top 0.254: R3.1 93.98,38.23 93.98,41.4 IC6.9
N$33
  Bottom 0.254: IC3.8 94.61,73.79 94.61,76.96 111.76,76.96 111.76,74.42 IC4.10
N$34
  Top 0.254: IC2.8 71.75,73.79 77.47,73.79 77.47,74.42 78.11,75.06 91.44,75.06 91.44,74.42 IC3.9
N$37  (via drill 0.61)
  Top 0.254: v29.21,31.24 29.21,26.16 22.23,19.18 Q1.2 | v75.56,29.97 80.01,29.97 v80.01,36.96
  Bottom 0.254: v29.21,31.24 59.05,31.24 60.33,29.97 v75.56,29.97 | v80.01,36.96 80.65,37.59 83.19,37.59 R3.2
OCLK
  Top 0.254: IC6.14 88.27,50.93 84.45,54.74 79.38,54.74 PIN9.1
PIN4  (via drill 0.61)
  Top 0.254: v66.68,36.32 v66.68,43.94
  Bottom 0.254: v66.68,43.94 64.77,43.94 64.77,50.29 62.87,52.2 60.96,52.2 60.96,54.1 PIN4.2 | v66.68,36.32 70.48,36.32 70.48,34.42 77.47,34.42 78.74,35.69 83.82,35.69 84.45,35.05 92.08,35.05 92.71,34.42 92.71,33.78 103.5,33.78 104.14,33.15 108.59,33.15 108.59,36.32 111.76,36.32 X1.4
PIN9  (via drill 0.61)
  Top 0.254: v109.86,56.01 116.84,56.01 116.84,24.89 114.94,22.99 112.39,22.99 X1.9
  Bottom 0.254: v109.86,56.01 100.33,56.01 99.06,57.28 76.84,57.28 76.84,56.01 PIN9.2
PIN22  (via drill 0.61)
  Top 0.762: v109.22,19.81 109.86,19.18 109.86,11.56 111.12,10.29 116.2,10.29 116.2,20.45 114.94,21.72 X1.22
  Bottom 0.762: v109.22,19.81 109.22,20.45 109.86,20.45 109.86,26.16 75.56,26.16 69.85,20.45 67.31,20.45 67.31,19.81 PIN22.2
RESET  (via drill 0.61)
  Top 0.254: v85.72,37.59 82.55,34.42 82.55,18.54 87.63,13.46 v87.63,8.38
  Bottom 0.254: v85.72,37.59 91.44,37.59 91.44,41.4 IC6.8 | v87.63,8.38 92.71,8.38 93.34,7.75 ST1.B2
STROBE
  Top 0.254: IC6.7 89.53,43.31 95.25,49.02 95.25,72.52 97.79,75.06 109.22,75.06 109.22,74.42 IC4.11
VCC  (via drill 0.61)
  Top 0.762: 53.98,71.88 55.25,71.88 55.25,72.52 IC2.14 | 53.98,71.88 51.44,71.88 C1.1 | C9.1 55.88,21.72 55.88,42.04 57.79,43.94 57.79,46.48 55.88,48.39 C5.1 55.88,49.66 55.88,52.2 | 53.98,71.88 53.98,62.36 55.88,60.45 55.88,52.2 | 75.56,71.88 78.11,71.88 78.11,72.52 IC3.14 | 75.56,71.88 74.3,71.88 C2.1 | 71.75,50.29 73.03,50.29 IC6.20 | 71.75,50.29 69.85,50.29 IC8.14 | IC10.20 73.03,20.45 68.58,24.89 68.58,30.61 67.31,31.88 C8.1 67.31,33.15 65.41,35.05 65.41,47.12 67.94,49.66 IC8.14 | 75.56,71.88 75.56,63.63 71.75,59.82 71.75,50.29 | 55.88,52.2 67.94,52.2 67.94,50.93 IC8.14 | C10.1 99.06,19.18 100.97,21.08 100.97,46.48 99.06,48.39 C6.1 99.06,49.66 99.06,71.88 | IC4.1 101.6,66.8 101.6,71.88 IC4.14 | 99.06,71.88 100.97,71.88 100.97,72.52 IC4.14 | 99.06,71.88 97.16,71.88 C3.1 | IC4.14 102.23,72.52 103.5,72.52 IC4.13 104.78,72.52 109.22,68.07 | R24.2 106.68,54.74 109.22,57.28 109.22,64.26 IC4.4 109.22,66.8 109.22,68.07 | 109.22,68.07 114.94,68.07 118.75,71.88 C4.1 119.38,72.52 118.75,73.15 118.75,73.79 115.57,76.96 47.62,76.96 | 31.12,44.58 30.48,43.94 30.48,23.62 IC9.20 30.48,21.08 30.48,16 IC9.1 30.48,13.46 28.58,11.56 28.58,9.65 26.04,9.65 R22.2 | 31.12,44.58 35.56,49.02 IC5.16 | 31.12,44.58 31.12,69.98 33.02,71.88 IC1.14 33.02,74.42 33.02,76.96 47.62,76.96 | 47.62,76.96 v47.62,76.33
  Bottom 0.762: R22.2 25.4,9.02 25.4,7.75 ST1.B29 | v47.62,76.33 50.8,76.33 50.8,72.52 C1.1
VCCO  (via drill 0.61)
  Top 0.762: IC7.3 18.42,33.78 24.77,33.78 24.77,30.61 C7.+ | 104.78,28.7 104.78,36.32 106.68,38.23 110.49,38.23 110.49,38.86 111.12,39.5 X1.3 | 104.78,28.7 104.78,26.8 111.12,20.45 X1.10 | v102.23,28.7 104.78,28.7
  Bottom 0.762: v102.23,28.7 60.33,28.7 59.05,29.97 26.04,29.97 C7.+